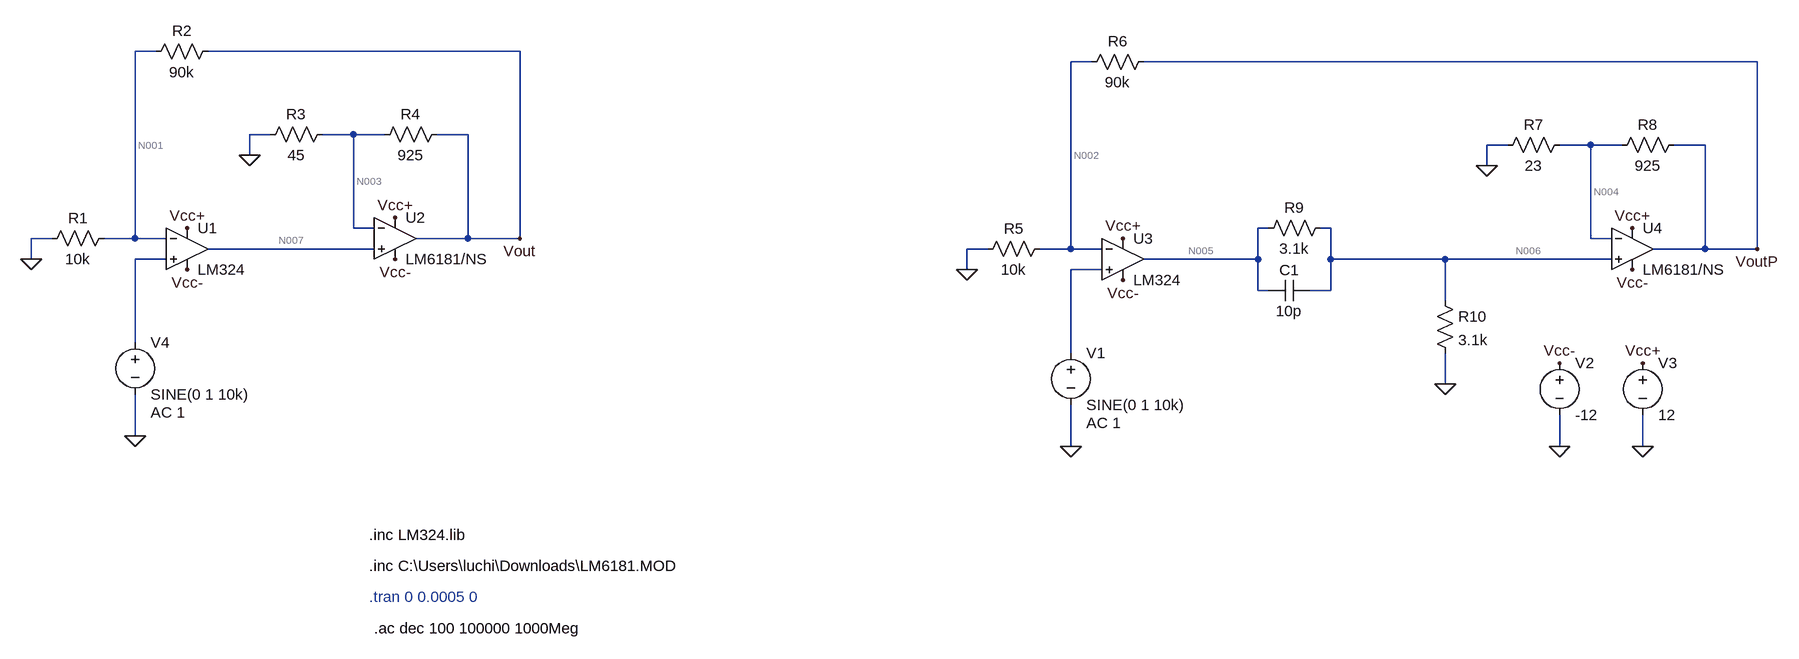
[diagram p0: schematic Laboratorio 3.asc]
Laboratorio 3.asc, the LTspice schematic file:
Version 4.1
SHEET 1 1988 984
WIRE -528 -80 -560 -80
WIRE 32 -80 -448 -80
WIRE 912 -64 880 -64
WIRE 1936 -64 992 -64
WIRE -352 48 -384 48
WIRE -224 48 -272 48
WIRE -176 48 -224 48
WIRE -48 48 -96 48
WIRE 1552 64 1520 64
WIRE 1680 64 1632 64
WIRE 1728 64 1680 64
WIRE 1856 64 1808 64
WIRE -384 80 -384 48
WIRE 1520 96 1520 64
WIRE -224 192 -224 48
WIRE -192 192 -224 192
WIRE 1184 192 1168 192
WIRE 1280 192 1264 192
WIRE -688 208 -720 208
WIRE -560 208 -560 -80
WIRE -560 208 -608 208
WIRE -512 208 -560 208
WIRE -48 208 -48 48
WIRE -48 208 -128 208
WIRE 32 208 32 -80
WIRE 32 208 -48 208
WIRE 1680 208 1680 64
WIRE 1712 208 1680 208
WIRE -192 224 -448 224
WIRE 752 224 720 224
WIRE 880 224 880 -64
WIRE 880 224 832 224
WIRE 928 224 880 224
WIRE 1856 224 1856 64
WIRE 1856 224 1776 224
WIRE 1936 224 1936 -64
WIRE 1936 224 1856 224
WIRE -720 240 -720 208
WIRE -512 240 -560 240
WIRE 1168 240 1168 192
WIRE 1168 240 992 240
WIRE 1280 240 1280 192
WIRE 1456 240 1280 240
WIRE 1712 240 1456 240
WIRE 720 256 720 224
WIRE 928 256 880 256
WIRE 1168 288 1168 240
WIRE 1184 288 1168 288
WIRE 1280 288 1280 240
WIRE 1280 288 1248 288
WIRE 1456 304 1456 240
WIRE -560 368 -560 240
WIRE 880 384 880 256
WIRE 1456 432 1456 384
WIRE -560 512 -560 448
WIRE 880 528 880 464
WIRE 1632 528 1632 480
WIRE 1760 528 1760 480
FLAG -384 80 0
FLAG -720 240 0
FLAG -560 512 0
FLAG 1632 528 0
FLAG 1760 528 0
FLAG 1632 400 Vcc-
FLAG -480 256 Vcc-
FLAG -160 240 Vcc-
FLAG 1760 400 Vcc+
FLAG -160 176 Vcc+
FLAG -480 192 Vcc+
FLAG 32 208 Vout
FLAG 1520 96 0
FLAG 720 256 0
FLAG 880 528 0
FLAG 960 272 Vcc-
FLAG 1744 256 Vcc-
FLAG 1744 192 Vcc+
FLAG 960 208 Vcc+
FLAG 1456 432 0
FLAG 1936 224 VoutP
SYMBOL OpAmps\\opamp2 -480 160 R0
SYMATTR InstName U1
SYMATTR Value LM324
SYMBOL OpAmps\\opamp2 -160 144 R0
SYMATTR InstName U2
SYMATTR Value LM6181/NS
SYMBOL res -592 192 R90
WINDOW 0 0 56 VBottom 2
WINDOW 3 32 56 VTop 2
SYMATTR InstName R1
SYMATTR Value 10k
SYMBOL res -432 -96 R90
WINDOW 0 0 56 VBottom 2
WINDOW 3 32 56 VTop 2
SYMATTR InstName R2
SYMATTR Value 90k
SYMBOL res -256 32 R90
WINDOW 0 0 56 VBottom 2
WINDOW 3 32 56 VTop 2
SYMATTR InstName R3
SYMATTR Value 45
SYMBOL res -80 32 R90
WINDOW 0 0 56 VBottom 2
WINDOW 3 32 56 VTop 2
SYMATTR InstName R4
SYMATTR Value 925
SYMBOL voltage 880 368 R0
WINDOW 123 24 124 Left 2
WINDOW 39 0 0 Left 0
SYMATTR Value2 AC 1
SYMATTR InstName V1
SYMATTR Value SINE(0 1 10k)
SYMBOL voltage 1632 384 R0
WINDOW 123 0 0 Left 0
WINDOW 39 0 0 Left 0
SYMATTR InstName V2
SYMATTR Value -12
SYMBOL voltage 1760 384 R0
WINDOW 123 0 0 Left 0
WINDOW 39 0 0 Left 0
SYMATTR InstName V3
SYMATTR Value 12
SYMBOL OpAmps\\opamp2 960 176 R0
SYMATTR InstName U3
SYMATTR Value LM324
SYMBOL OpAmps\\opamp2 1744 160 R0
SYMATTR InstName U4
SYMATTR Value LM6181/NS
SYMBOL res 848 208 R90
WINDOW 0 0 56 VBottom 2
WINDOW 3 32 56 VTop 2
SYMATTR InstName R5
SYMATTR Value 10k
SYMBOL res 1008 -80 R90
WINDOW 0 0 56 VBottom 2
WINDOW 3 32 56 VTop 2
SYMATTR InstName R6
SYMATTR Value 90k
SYMBOL res 1648 48 R90
WINDOW 0 0 56 VBottom 2
WINDOW 3 32 56 VTop 2
SYMATTR InstName R7
SYMATTR Value 23
SYMBOL res 1824 48 R90
WINDOW 0 0 56 VBottom 2
WINDOW 3 32 56 VTop 2
SYMATTR InstName R8
SYMATTR Value 925
SYMBOL res 1280 176 R90
WINDOW 0 0 56 VBottom 2
WINDOW 3 32 56 VTop 2
SYMATTR InstName R9
SYMATTR Value 3.1k
SYMBOL res 1440 288 R0
SYMATTR InstName R10
SYMATTR Value 3.1k
SYMBOL cap 1248 272 R90
WINDOW 0 0 32 VBottom 2
WINDOW 3 32 32 VTop 2
SYMATTR InstName C1
SYMATTR Value 10p
SYMBOL voltage -560 352 R0
WINDOW 123 24 124 Left 2
WINDOW 39 0 0 Left 0
SYMATTR Value2 AC 1
SYMATTR InstName V4
SYMATTR Value SINE(0 1 10k)
TEXT -200 760 Left 2 ;.tran 0 0.0005 0
TEXT -200 664 Left 2 !.inc LM324.lib
TEXT -200 712 Left 2 !.inc C:\\Users\\luchi\\Downloads\\LM6181.MOD
TEXT -192 808 Left 2 !.ac dec 100 100000 1000Meg

The netlist it stands for:
* Laboratorio 3.asc
X§U1 N008 N001 Vcc+ Vcc- N007 LM324  ; pins In+ In- V+ V- OUT
X§U2 N007 N003 Vcc+ Vcc- Vout LM6181/NS  ; pins In+ In- V+ V- OUT
R1 N001 0 10k
R2 Vout N001 90k
R3 N003 0 45
R4 Vout N003 925
V1 N009 0 SINE(0 1 10k) AC 1
V2 Vcc- 0 -12
V3 Vcc+ 0 12
X§U3 N009 N002 Vcc+ Vcc- N005 LM324  ; pins In+ In- V+ V- OUT
X§U4 N006 N004 Vcc+ Vcc- VoutP LM6181/NS  ; pins In+ In- V+ V- OUT
R5 N002 0 10k
R6 VoutP N002 90k
R7 N004 0 23
R8 VoutP N004 925
R9 N006 N005 3.1k
R10 N006 0 3.1k
C1 N006 N005 10p
V4 N008 0 SINE(0 1 10k) AC 1
* .tran 0 0.0005 0
.inc LM324.lib
.inc C:\Users\luchi\Downloads\LM6181.MOD
.ac dec 100 100000 1000Meg
.backanno
.end

* Results of the author's LTspice run, read from the files saved beside the schematic
* Operating Point, zero values left out:
*   V(n001) = -33.63 µV
*   V(n002) = -33.64 µV
*   V(n003) = 111.4 µV
*   V(n004) = 58.25 µV
*   V(n005) = -1.522 mV
*   V(n006) = -2.714 mV
*   V(n007) = -2.661 mV
*   V(vcc+) = 12 V
*   V(vcc-) = -12 V
*   V(vout) = -2.131 mV
*   V(voutp) = -2.131 mV
*   I(R1) = -3.363 nA
*   I(R10) = -875.4 nA
*   I(R2) = -23.3 nA
*   I(R3) = 2.475 µA
*   I(R4) = -2.424 µA
*   I(R5) = -3.364 nA
*   I(R6) = -23.3 nA
*   I(R7) = 2.533 µA
*   I(R8) = -2.367 µA
*   I(R9) = -384.3 nA
*   I(V1) = 19.92 nA
*   I(V2) = 15.73 mA
*   I(V3) = -15.74 mA
*   I(V4) = 19.92 nA
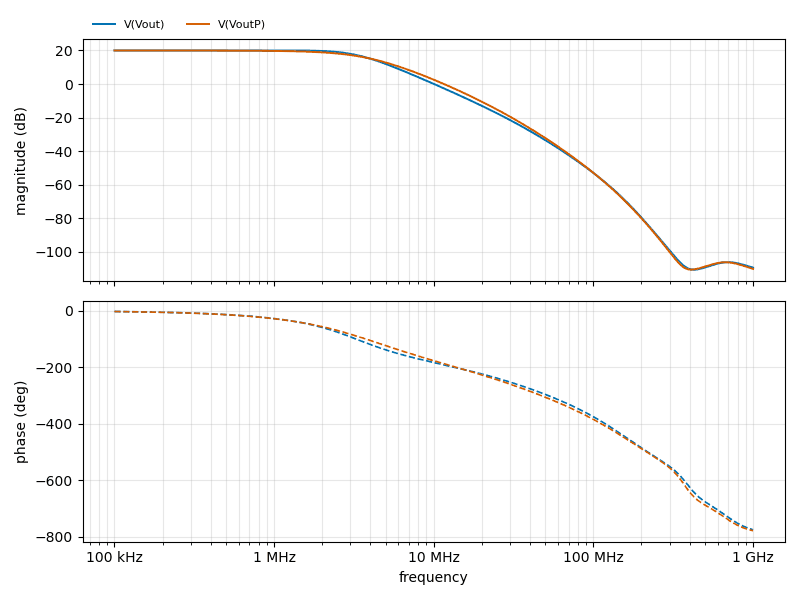
[diagram p1: AC Analysis of Laboratorio 3.asc, plotted from the saved traces]
* AC Analysis, 1 run:
*   V(Vout): 20.00 dB at 100 kHz, -109.38 dB at 1 GHz, peak 20.04 dB at 1 MHz, 3 dB below the peak at 3.372 MHz
*   V(VoutP): 20.00 dB at 100 kHz, -110.12 dB at 1 GHz, peak 20.00 dB at 100 kHz, 3 dB below the peak at 3.158 MHz